# Altium schematic sheet 5V.SchDoc
size A4; SheetNumber: 2; SheetTotal: 3; SPICEModelCacheJCBACRJR: <root> / <DocumentId>JCBACRJR</DocumentId> / <CacheFrame Number="0"> / <Model Name="cout" Kind="CKT"> / <Text>*$ / .SUBCKT Cout 2 4 / R1 2 3 0.0031 / C1 3 4 7.231815776419501E-6 / R3 5 4 5 / R2 2 4 1.3827785868946785E8 / R4 3 26 688888.8888888889 / R6 3 7 688.8888888888889 / C5 7 1 2.1695447329258503E-7 / R7 3 10 68.88888888888889 / C6 10 1 2.1695447329258503E-7 / R8 3 13 6.888888888888889 / C7 13 1 2.1695447329258503E-7 / C2 26 1 2.1695447329258503E-7 / R9 3 28 68888.88888888889 / C3 28 1 2.1695447329258503E-7 / R10 3 29 6888.88888888889 / C4 29 1 2.1695447329258503E-7 / L8 1 5 15p / R24 1 5 0.0093 / L12 5 4 1n / .ENDS</Text> / </Model> / <Model Name="3010_74438333022_2.2u" Kind="CKT"> / <Text>******* / .subckt 3010_74438333022_2.2u 1 2 / Rp 1 2 5803.666667 / Cp 1 2 4.724p / Rs 1 N3 0.15 / L1 N3 2 2.1u / .ends 3010_74438333022_2.2u</Text> / </Model> / </CacheFrame> / </root>
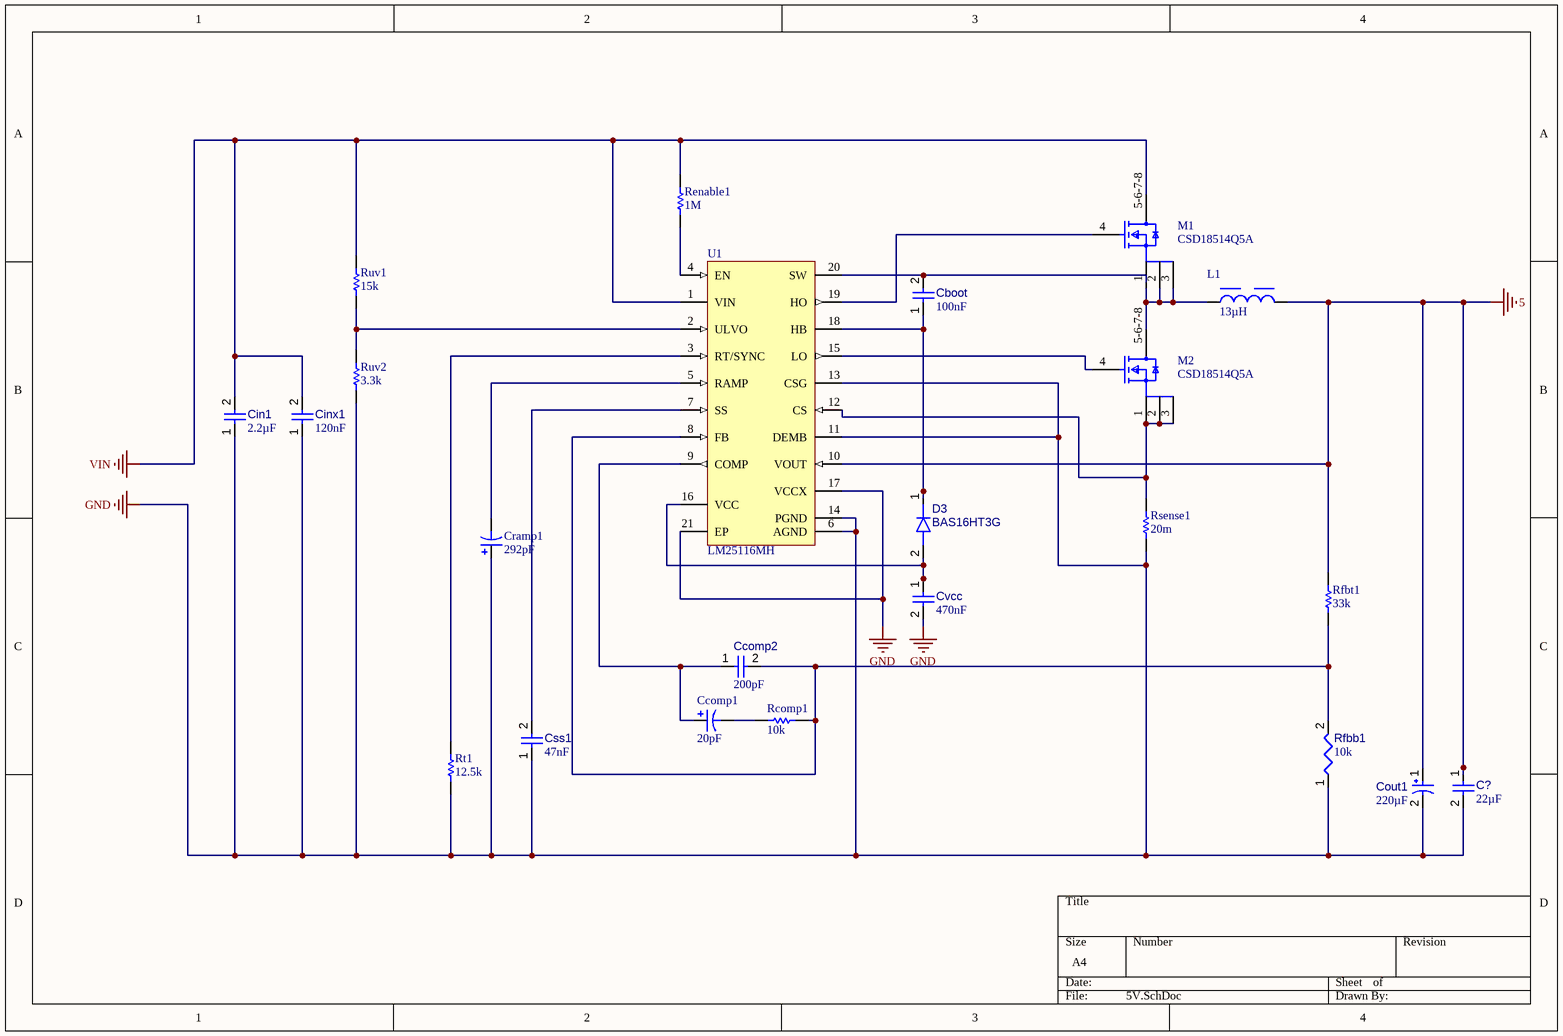
[diagram p0: 5V.SchDoc]

## Parts
C?  value 22µF  [CAPC0805(2012)145_L]  (hidden comment: Capacitor 22µF +/-40% 16V 0805)
Cboot  value 100nF  [CAPC2013X95X50LL10T25]  (hidden comment: Capacitor 100 nF +/-10% 50 V 0805)
Ccomp1  value 20pF  [C0805]  (hidden comment: Cap Pol3)
Ccomp2  value 200pF  [CAPC2013X135X45NL10T25]  (hidden comment: Capacitor 10 uF +/- 10% 16 V 0805)
Cin1  value 2.2µF  [CAPC2013X135X45NL10T25]  (hidden comment: Capacitor 1 uF +/- 10% 50 V 0805)
Cinx1  value 120nF  [CAPC2013X95X50LL10T25]  (hidden comment: Capacitor 100 nF +/-10% 50 V 0805)
Cout1  value 220µF  [CAPPR65-500-1250X1000X1350]  (hidden comment: ECA-1HM221)
Cramp1  value 292pF  [C0805]  (hidden comment: Cap Pol3)
Css1  value 47nF  [CAPC2013X95X50LL10T25]  (hidden comment: Capacitor 100 nF +/-10% 50 V 0805)
Cvcc  value 470nF  [CAPC0402(1005)60_L]  (hidden comment: Capacitor 470pF +/-20% 50V 0402)
D3  BAS16HT3G
L1  Inductance: 13µH  [WE-MAPI_3010]  (hidden comment: 74438333022)
M1  CSD18514Q5A  [FP-DQJ0008A-MFG]
M2  CSD18514Q5A  [FP-DQJ0008A-MFG]
Rcomp1  value 10k  [RESC2013X50X35ML15T15]  (hidden comment: Resistor 0R +/- 1% 0805 125 mW)
Renable1  value 1M  [RESC2013X50X35ML15T15]  (hidden comment: Resistor 0R +/- 1% 0805 125 mW)
Rfbb1  value 10k  [RESC2013X50X35ML15T15]  (hidden comment: Resistor 10k +/-1% 0805 125 mW)
Rfbt1  value 33k  [RESC2013X50X35ML15T15]  (hidden comment: Resistor 0R +/- 1% 0805 125 mW)
Rsense1  value 20m  [RESC2013X50X35ML15T15]  (hidden comment: Resistor 0R +/- 1% 0805 125 mW)
Rt1  value 12.5k  [RESC2013X50X35ML15T15]  (hidden comment: Resistor 0R +/- 1% 0805 125 mW)
Ruv1  value 15k  [RESC2013X50X35ML15T15]  (hidden comment: Resistor 0R +/- 1% 0805 125 mW)
Ruv2  value 3.3k  [RESC2013X50X35ML15T15]  (hidden comment: Resistor 0R +/- 1% 0805 125 mW)
U1  LM25116MH  [PWP0020A_N]

## Nets
5: C?.1 Cout1.1 L1.2 Rfbt1.2 U1.10(VOUT)
GND: C?.2 Cin1.1 Cinx1.1 Cout1.2 Cramp1.1 Css1.1 Cvcc.2 Rfbb1.1 Rsense1.1 Rt1.1 Ruv2.1 U1.6(AGND) U1.11(DEMB) U1.13(CSG) U1.14(PGND) U1.17(VCCX) U1.21(EP)
VIN: Cin1.2 Cinx1.2 M1.5-6-7-8(D) Renable1.2 Ruv1.2 U1.1(VIN)
NetCboot_1: Cboot.1 D3.1(K) U1.18(HB)
NetCboot_2: Cboot.2 U1.20(SW)
NetCcomp1_1: Ccomp1.1 Ccomp2.1 U1.9(COMP)
NetCcomp1_2: Ccomp1.2 Rcomp1.2
NetCcomp2_2: Ccomp2.2 Rcomp1.1 Rfbb1.2 Rfbt1.1 U1.8(FB)
NetCramp1_2: Cramp1.2 U1.5(RAMP)
NetCss1_2: Css1.2 U1.7(SS)
NetCvcc_1: Cvcc.1 D3.2(A) U1.16(VCC)
NetL1_1: L1.1 M1.1(S) M1.2(S) M1.3(S) M2.5-6-7-8(D)
NetM1_4: M1.4(G) U1.19(HO)
NetM2_1: M2.1(S) M2.2(S) M2.3(S) Rsense1.2 U1.12(CS)
NetM2_4: M2.4(G) U1.15(LO)
NetRenable1_1: Renable1.1 U1.4(EN)
NetRt1_2: Rt1.2 U1.3(RT/SYNC)
NetRuv1_1: Ruv1.1 Ruv2.2 U1.2(ULVO)

## Library data of the parts
C? = CMP-001-00081-4: Chip Capacitor, 22µF +/-40%, 16V, 0805, Thickness 1.45 mm; Tolerance: 5%; Voltage Rating: 16V; Mounting Technology: SMT; Pins: 2; Max Operating Temperature: 85°C; Case/Package: 0805; Min Operating Temperature: -55°C
Cboot Cinx1 Css1 = CMP-001-00018-6: Chip Capacitor, 100 nF, +/- 10%, 50 V, 0805 (2012 Metric); Capacitor Type: Ceramic; Voltage Rating: 50V; Pins: 2; Max Operating Temperature: 125°C; Min Operating Temperature: -55°C; Mounting Technology: SM; Case/Package: 0805; RoHS Compliant: True; Tolerance: 10%
Ccomp1 Cramp1 = CMP-001-00095-1: Polarized Capacitor (Surface Mount); Signal Integrity: Cap Pol; Component Type: Standard; Case/Package: Chip Capacitor; Source: Miscellaneous Devices.SchLib; Publisher: Altium Limited; Published: 8-Jun-2000; PackageReference: C0805; LatestRevisionDate: 29-May-2009; Pins: 2; LatestRevisionNote: IPC-7351 Footprint Added.; Design Item ID: Cap Pol3
Ccomp2 = CMP-001-00015-6: Chip Capacitor, 10 uF, +/- 10%, 16 V, 0805 (2012 Metric); Voltage Rating: 16V; Capacitor Type: Ceramic; RoHS Compliant: True; Max Operating Temperature: 85°C; Min Operating Temperature: -55°C; Mounting Technology: SM; Tolerance: 10%; Case/Package: 0805; Pins: 2
Cin1 = CMP-001-00007-6: Chip Capacitor, 1 uF, +/- 10%, 50 V, 0805 (2012 Metric); Capacitor Type: Ceramic; Voltage Rating: 50V; Min Operating Temperature: -55°C; RoHS Compliant: True; Mounting Technology: SM; Case/Package: 0805; Max Operating Temperature: 125°C; Tolerance: 10%; Pins: 2
Cout1 = CMP-001-00028-7: Aluminum Electrolytic Capacitor, 220 uF, +/- 20%, 50 V, -40 to 85 degC, 2-Pin THD, RoHS, Bulk; Manufacturer: Panasonic; Ripple Current (AC): 400mA; Voltage Rating: 50V; Case/Package: Radial; Packaging: Bulk; Package Quantity: 200; Min Operating Temperature: -40°C; Datasheet Version: Mar-16; Package Reference: CAPPR65-500-1250X1000X1350; Mounting Technology: TH; Ripple Current: 400mA; Pins: 2; Package Description: 2-Pin Radial Lead, Dia 10 mm, Body Length 12.5 mm; RoHS Compliant: True; Max Operating Temperature: 85°C; Lead Pitch: 5mm; Tolerance: 20%; Manufacturer URL: http://www.panasonic.com/; Diameter: 10mm; Capacitor Type: Electrolytic; Datasheet URL: http://industrial.panasonic.com/cdbs/www-data/pdf/RDF0000/DMF0000COL68.pdf
Cvcc = CMP-001-00068-4: Chip Capacitor, 470pF +/-20%, 50V, 0402, Thickness 0.6 mm; Tolerance: 20%; Mounting Technology: SMT; Max Operating Temperature: 85°C; Min Operating Temperature: -55°C; Pins: 2; Voltage Rating: 50V; Case/Package: 0402
D3 = CMP-004-00126-1: Rectifier Diode Small Signal Switching 0.2A 6ns Automotive 2-Pin SOD-323 T/R; Forward Voltage: 715mV; Max Operating Temperature: 150°C; Pins: 2; Min Operating Temperature: -55°C; Case/Package: SOD-323-2
L1 = CMP-006-00070-1: WE-MAPI SMT Power Inductor, size 3010, 2.2µH, 2.35A, 50MHz; Manufacturer: Wurth Elektronik; Saturation Current @ 30%: 4.85A; DC Resistance: 150mO; Operating Voltage (DC): 80V; Component Type: Standard; Design Item ID: 74438333022; Height: 1mm; Category: Power Inductors; Pins: 2; ComponentLink2URL: https://www.we-online.com/redexpert/spec/74438333022?ad; ComponentLink1URL: https://www.we-online.com/redexpert/article/74438333022?ad; Mount: Surface Mount; Max Operating Temperature: 125°C; ComponentLink2Description: Datasheet Link; Case/Package: 3010; Packaging: Tape and Reel; Min Operating Temperature: -40°C; ComponentLink1Description: Website Link; Source: WE-MAPI.SchLib; Performance Rated Current: 2.35A; Manufacturer Part Number: 74438333022; Self Resonant Frequency: 50MHz; Length: 3mm; Width: 3mm; Match Code: WE-MAPI
M1 M2 = CMP-011-00052-1: 40-V, N channel NexFET™ power MOSFET, single SON 5 mm x 6 mm, 4.9 mOhm 8-VSONP -55 to 150; Pins: 8; Max Operating Temperature: 150°C; Min Operating Temperature: -55°C
Rcomp1 Renable1 Rfbt1 Rsense1 Rt1 Ruv1 Ruv2 = CMP-009-00001-5: Chip Resistor, 0 Ohm, +/- 1%, 125 mW, -55 to 155 degC, 0805 (2012 Metric); Voltage Rating: 150V; Power: 125mW; Mounting Technology: SM; Max Operating Temperature: 155°C; Case/Package: 0805; RoHS Compliant: True; Pins: 2; Min Operating Temperature: -55°C; Tolerance: 1%
Rfbb1 = CMP-009-00018-5: Chip Resistor, 10 KOhm, +/- 1%, 125 mW, -55 to 155 degC, 0805 (2012 Metric); Power: 125mW; Voltage Rating: 150V; Tolerance: 1%; Pins: 2; Min Operating Temperature: -55°C; Case/Package: 0805; Max Operating Temperature: 155°C; RoHS Compliant: True; Mounting Technology: SM
U1 = CMP-00024-00007-1: 6-42V Wide Vin, Current Mode Synchronous Buck Controller 20-HTSSOP -40 to 125; Min Operating Temperature: -40°C; Case/Package: HTSSOP EP; Mounting Technology: Surface Mount; Max Operating Temperature: 125°C; Pins: 20